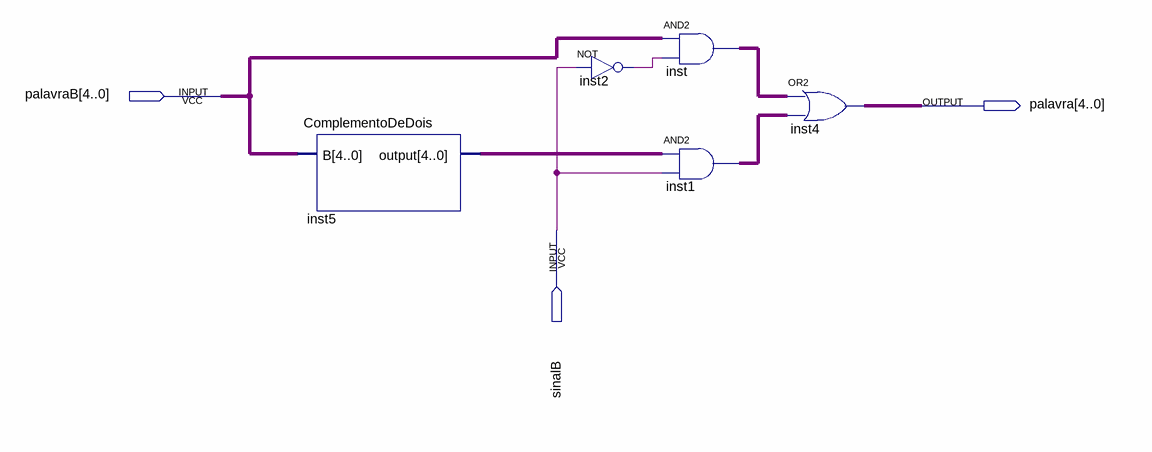
[diagram p0: schematic sheet]
// Quartus schematic MUXComplementoDeDois.bdf as structural Verilog: 5 symbols, 3 pins
module MUXComplementoDeDois (
  input  [4:0] palavraB,
  input  sinalB,
  output [4:0] palavra
);

  wire inst2_out;
  wire [4:0] inst1_out, inst5_output, inst_out;

  ComplementoDeDois inst5 (.B(palavraB), .\output (inst5_output));
  not inst2 (inst2_out, sinalB);
  assign inst_out = palavraB & {5{inst2_out}};  // AND2 inst, 5 bits wide
  assign inst1_out = inst5_output & {5{sinalB}};  // AND2 inst1, 5 bits wide
  assign palavra = inst_out | inst1_out;  // OR2 inst4, 5 bits wide
endmodule
